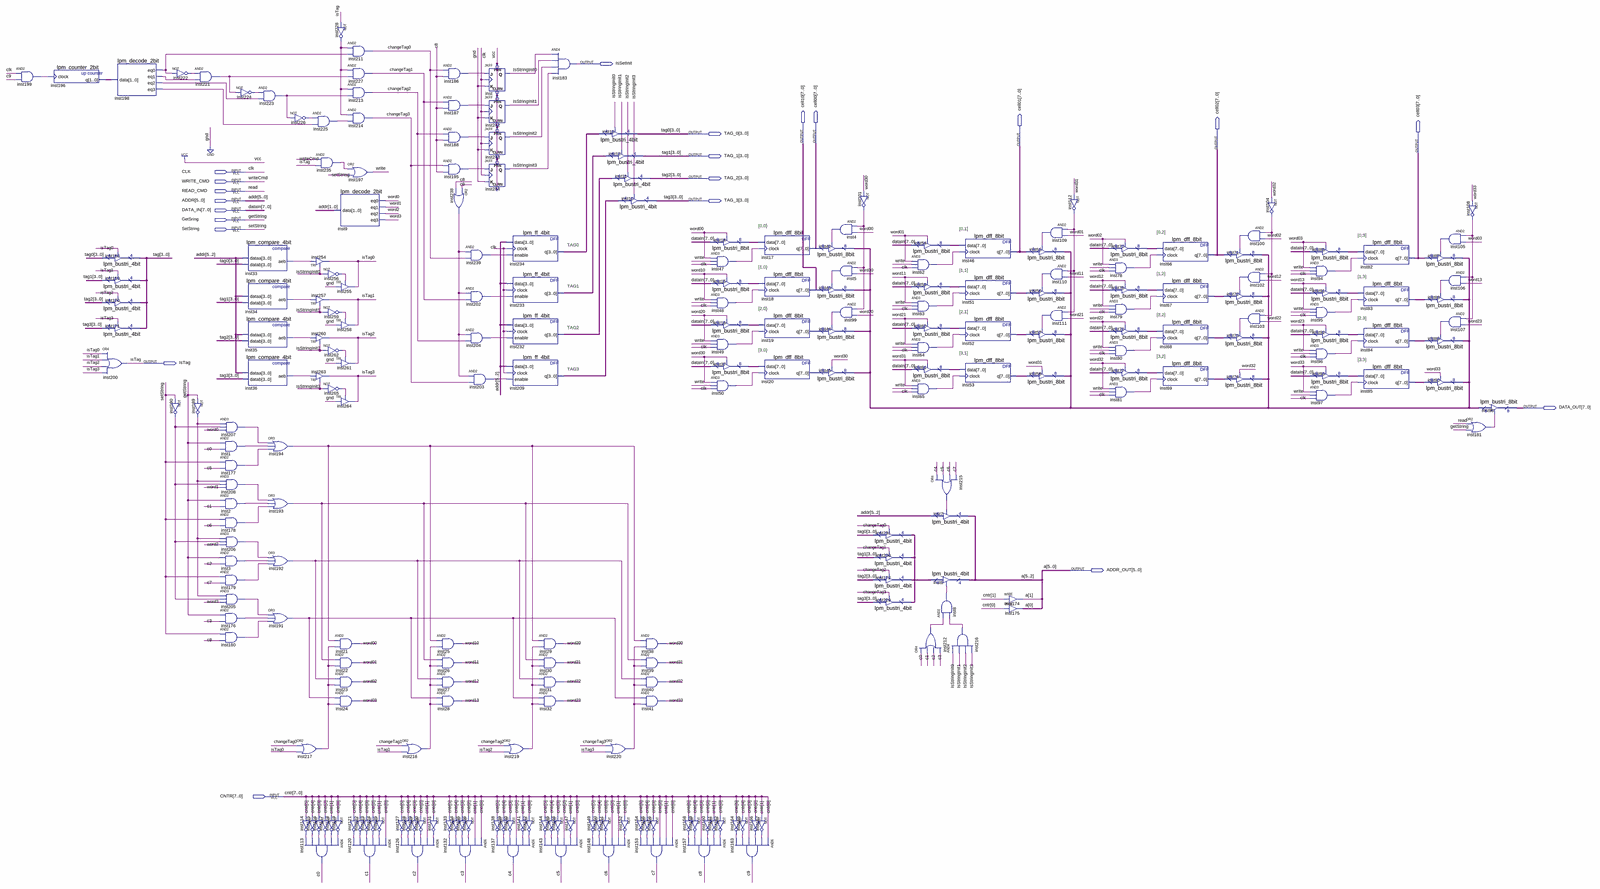
[diagram p0: schematic sheet, whole]
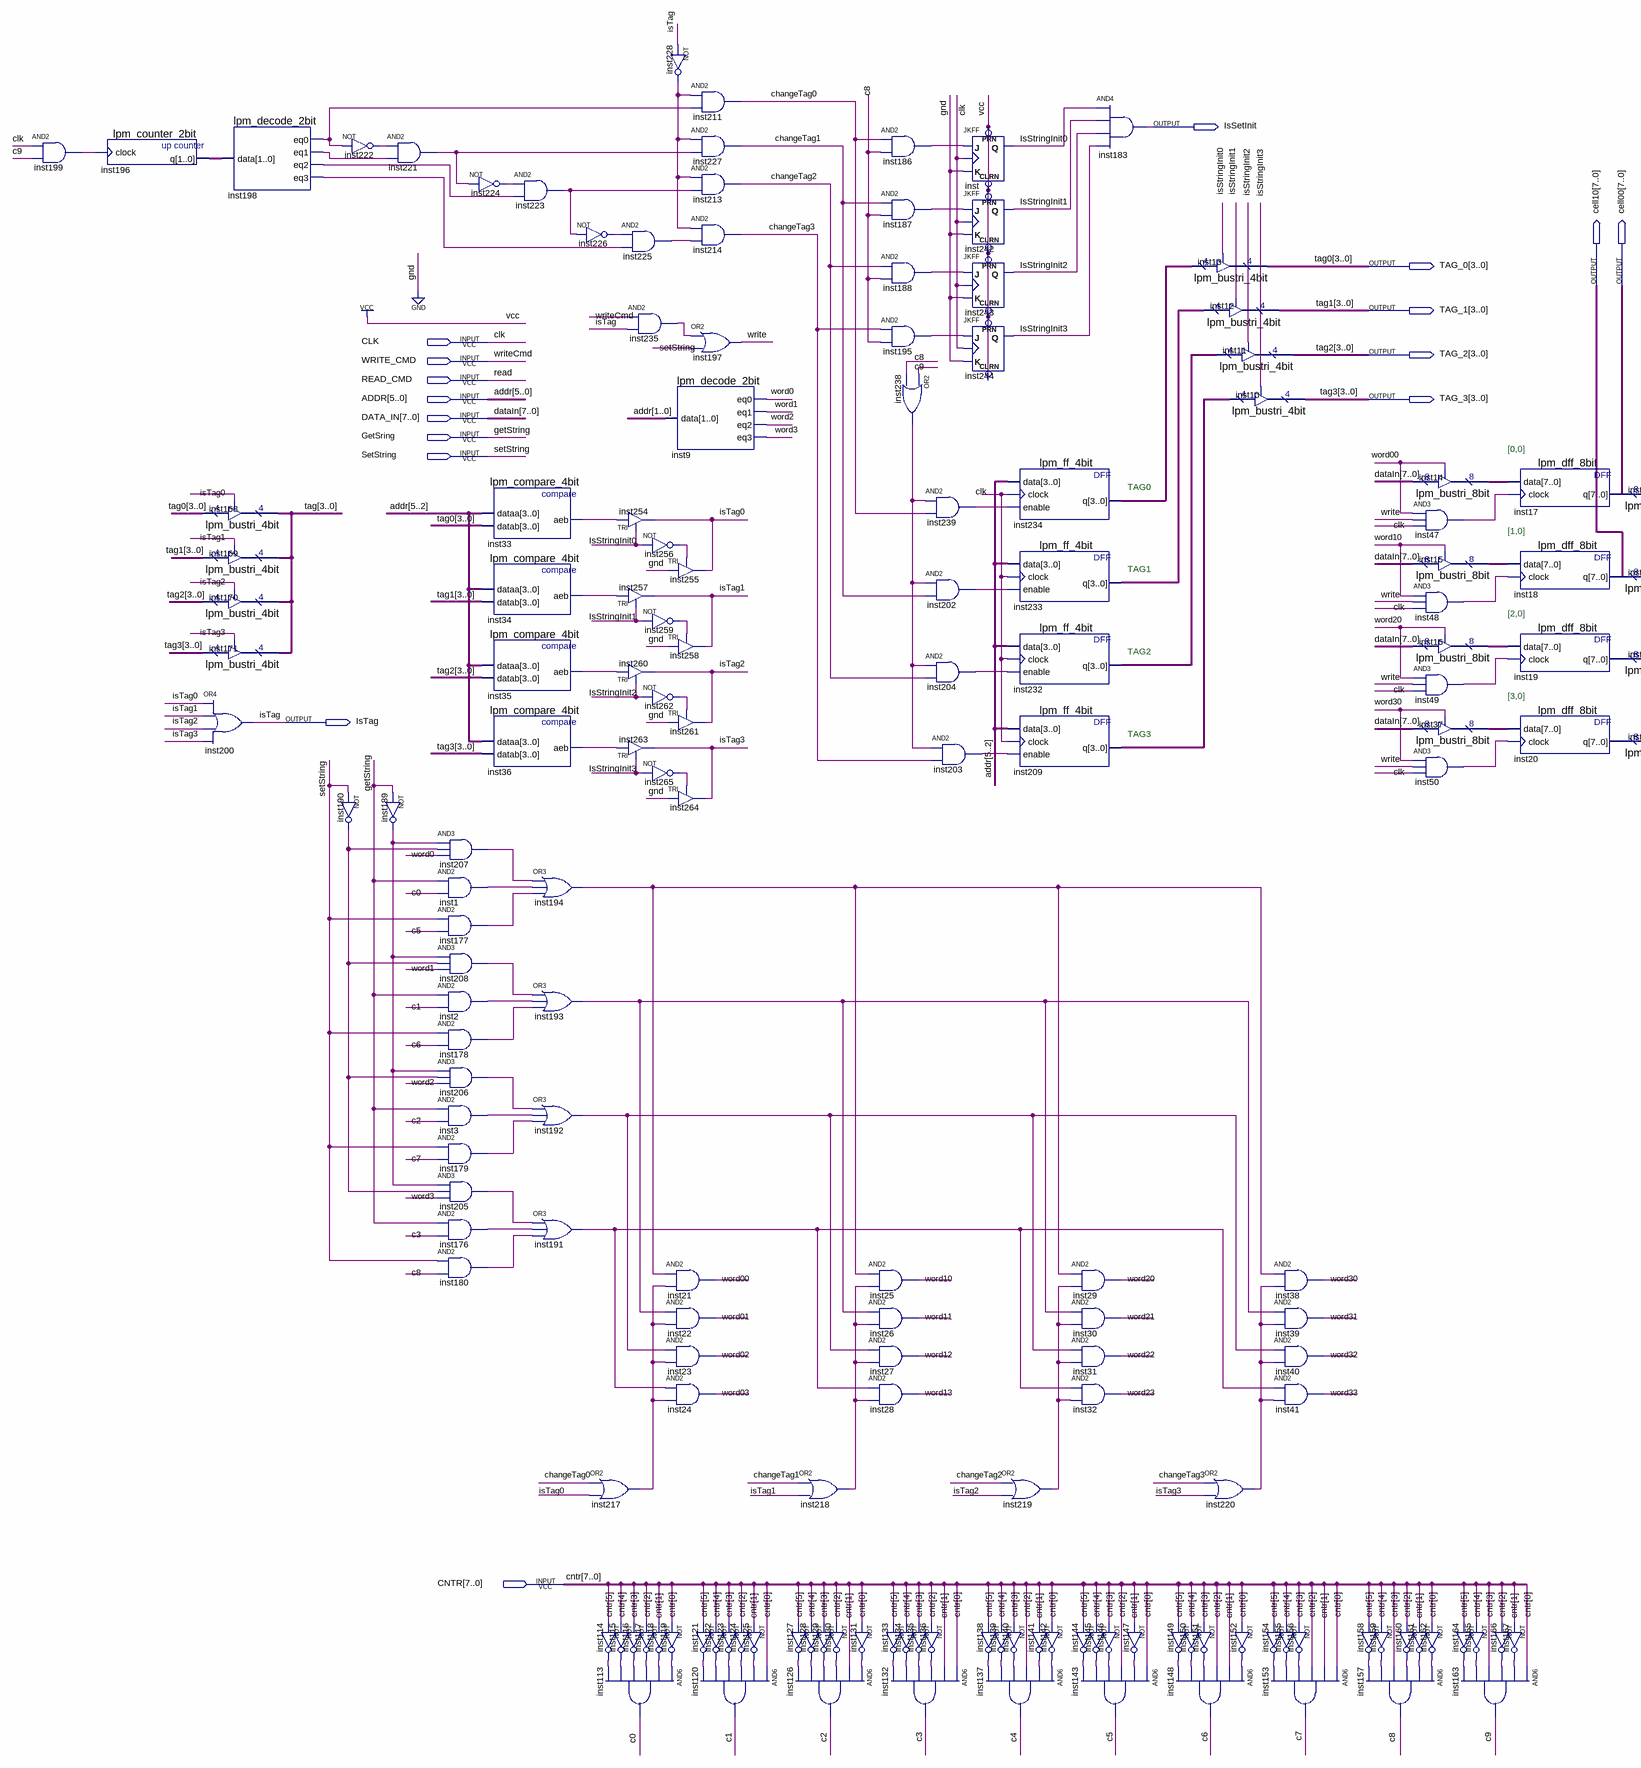
[diagram p1: schematic sheet, left part]
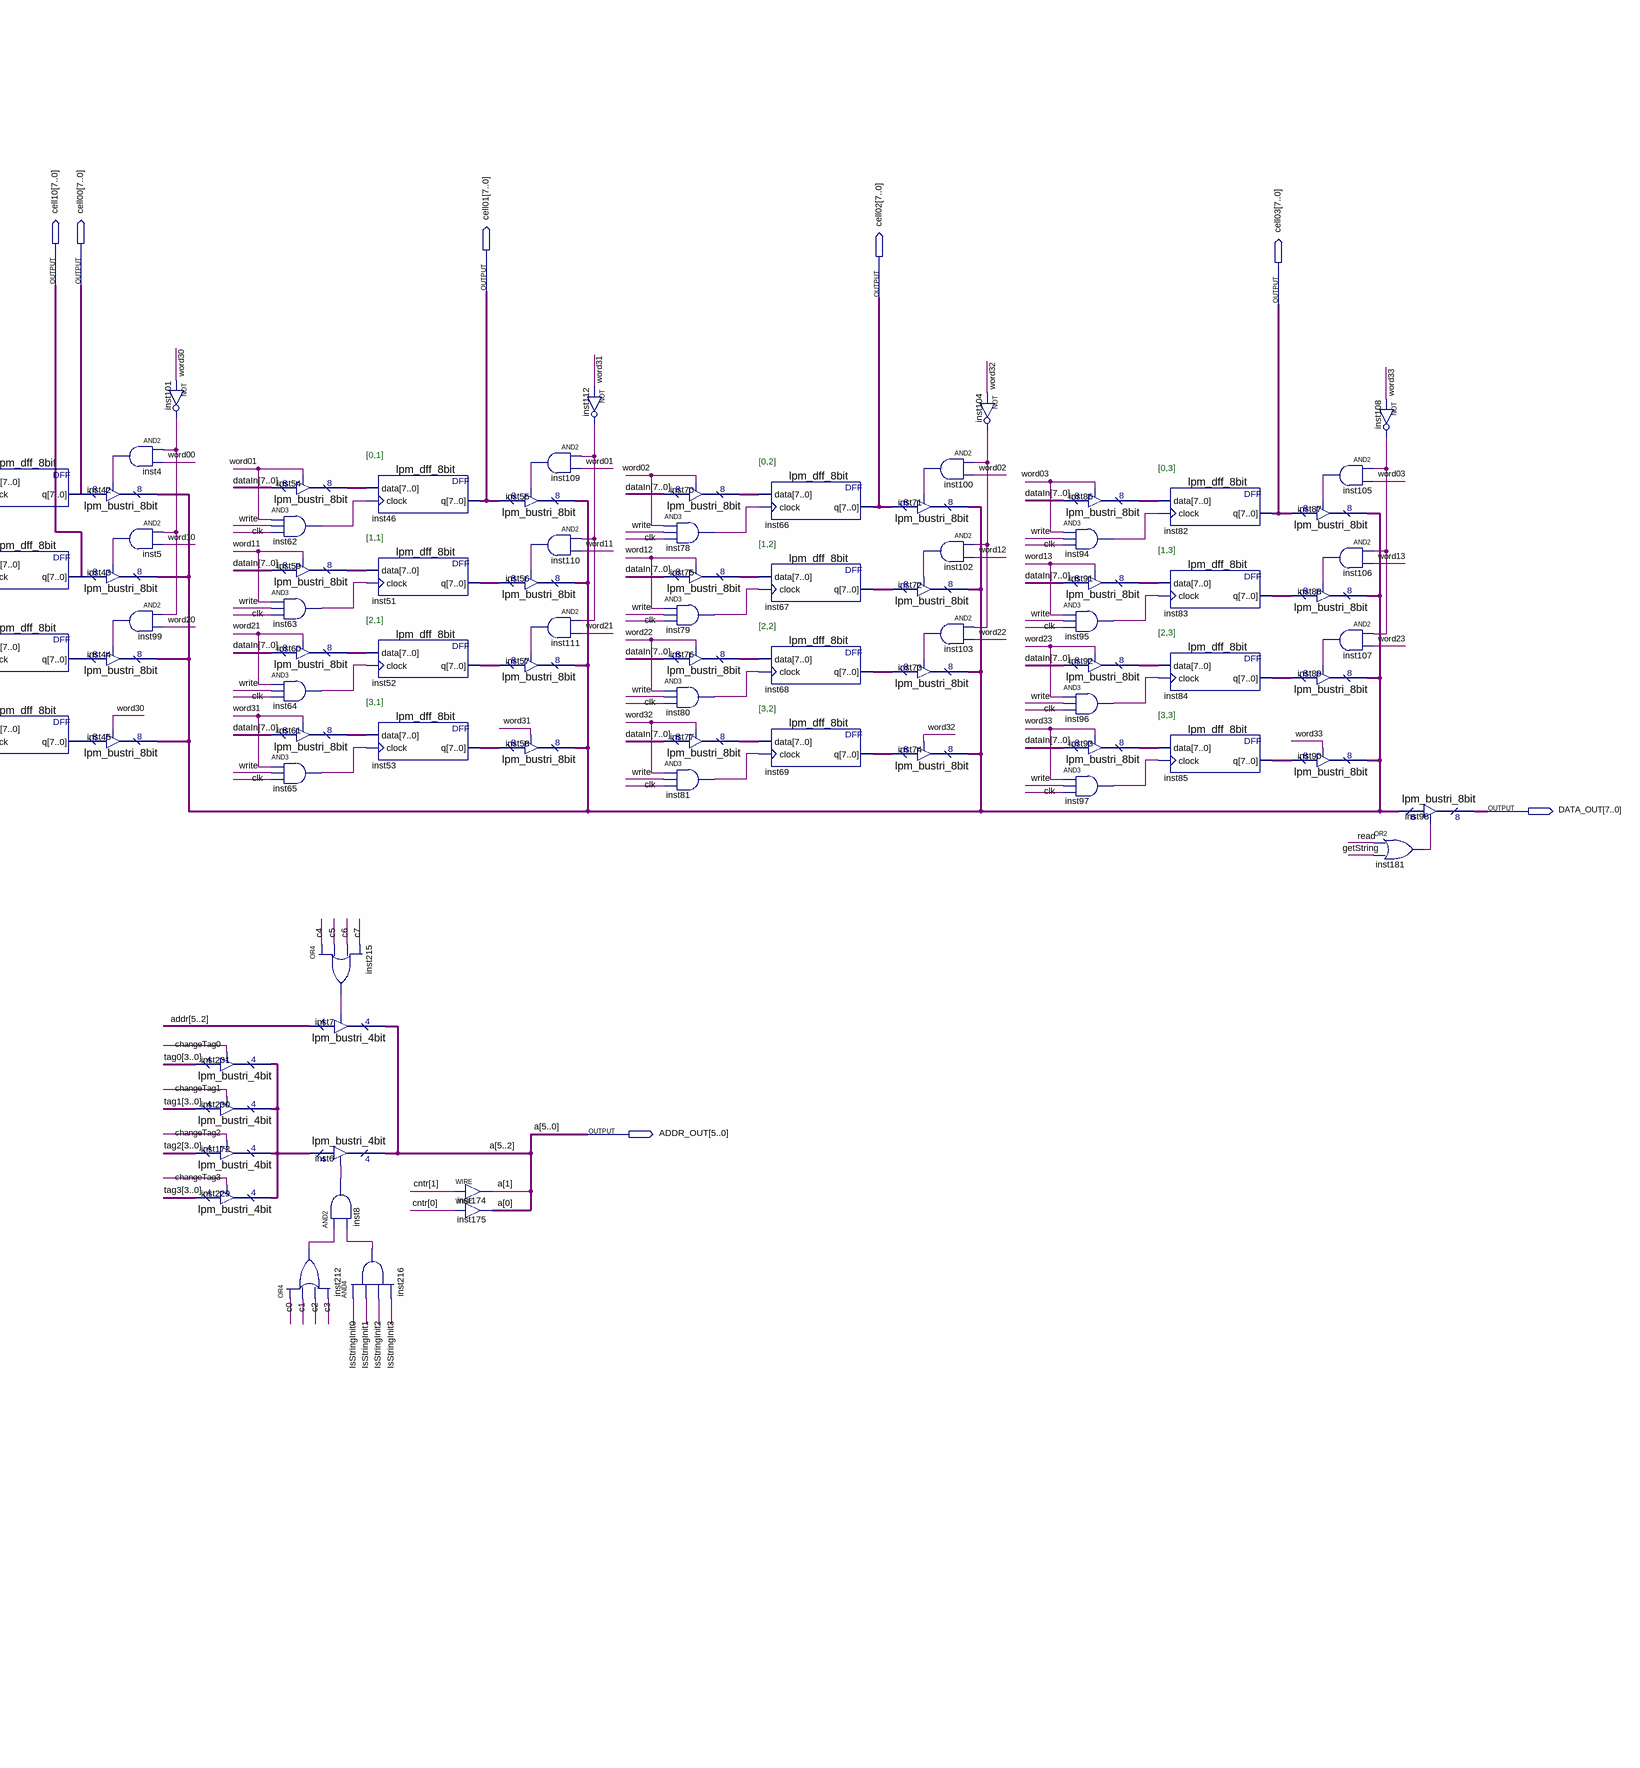
[diagram p2: schematic sheet, right part]
// Quartus schematic Set.bdf as structural Verilog: 247 symbols, 21 pins
module Set (
  input  CLK,
  input  WRITE_CMD,
  input  READ_CMD,
  input  [5:0] ADDR,
  input  [7:0] DATA_IN,
  input  GetSring,
  input  SetString,
  input  [7:0] CNTR,
  output IsSetInit,
  output [3:0] TAG_0,
  output [7:0] cell10,
  output [7:0] cell00,
  output [7:0] cell01,
  output [7:0] cell02,
  output [7:0] cell03,
  output [3:0] TAG_1,
  output [3:0] TAG_2,
  output [3:0] TAG_3,
  output IsTag,
  output [7:0] DATA_OUT,
  output [5:0] ADDR_OUT
);

  wire c0, c1, c2, c3, c4, c5, c6, c7, c8, c9, changeTag0, changeTag1, changeTag2, changeTag3, inst1_out,
       inst2_out, inst3_out, inst4_out, inst5_out, inst8_out, inst33_aeb, inst34_aeb, inst35_aeb, inst36_aeb,
       inst47_out, inst48_out, inst49_out, inst50_out, inst62_out, inst63_out, inst64_out, inst65_out,
       inst78_out, inst79_out, inst80_out, inst81_out, inst94_out, inst95_out, inst96_out, inst97_out,
       inst99_out, inst100_out, inst101_out, inst102_out, inst103_out, inst104_out, inst105_out, inst106_out,
       inst107_out, inst108_out, inst109_out, inst110_out, inst111_out, inst112_out, inst114_out,
       inst115_out, inst116_out, inst117_out, inst118_out, inst119_out, inst121_out, inst122_out,
       inst123_out, inst124_out, inst125_out, inst127_out, inst128_out, inst129_out, inst130_out,
       inst131_out, inst133_out, inst134_out, inst135_out, inst136_out, inst138_out, inst139_out,
       inst140_out, inst141_out, inst142_out, inst144_out, inst145_out, inst146_out, inst147_out,
       inst149_out, inst150_out, inst151_out, inst152_out, inst154_out, inst155_out, inst156_out,
       inst158_out, inst159_out, inst160_out, inst161_out, inst162_out, inst164_out, inst165_out,
       inst166_out, inst167_out, inst176_out, inst177_out, inst178_out, inst179_out, inst180_out,
       inst181_out, inst186_out, inst187_out, inst188_out, inst189_out, inst190_out, inst191_out,
       inst192_out, inst193_out, inst194_out, inst195_out, inst198_eq0, inst198_eq1, inst198_eq2,
       inst198_eq3, inst199_out, inst202_out, inst203_out, inst204_out, inst205_out, inst206_out,
       inst207_out, inst208_out, inst212_out, inst215_out, inst216_out, inst217_out, inst218_out,
       inst219_out, inst220_out, inst221_out, inst222_out, inst223_out, inst224_out, inst225_out,
       inst226_out, inst228_out, inst235_out, inst238_out, inst239_out, inst256_out, inst259_out,
       inst262_out, inst265_out, isStringInit0, isStringInit1, isStringInit2, isStringInit3, isTag0, isTag1,
       isTag2, isTag3, word0, word00, word1, word01, word02, word2, word3, word03, word10, word11, word12,
       word13, word20, word21, word22, word23, word30, word31, word32, word33, write;
  wire [1:0] inst196_q;
  wire [3:0] inst209_q, inst231_tridata, inst232_q, inst233_q, inst234_q, tag;
  wire [7:0] inst14_tridata, inst15_tridata, inst16_tridata, inst19_q, inst20_q, inst37_tridata,
       inst42_tridata, inst51_q, inst52_q, inst53_q, inst54_tridata, inst59_tridata, inst60_tridata,
       inst61_tridata, inst67_q, inst68_q, inst69_q, inst70_tridata, inst75_tridata, inst76_tridata,
       inst77_tridata, inst83_q, inst84_q, inst85_q, inst86_tridata, inst91_tridata, inst92_tridata,
       inst93_tridata;

  and inst199 (inst199_out, CLK, c9);
  lpm_counter_2bit inst196 (.clock(inst199_out), .q(inst196_q));
  lpm_decode_2bit inst198 (
    .data(inst196_q), .eq0(inst198_eq0), .eq1(inst198_eq1), .eq2(inst198_eq2), .eq3(inst198_eq3));
  lpm_bustri_4bit inst168 (.enabledt(isTag0), .data(TAG_0), .tridata(tag));
  lpm_bustri_4bit inst169 (.enabledt(isTag1), .data(TAG_1), .tridata(tag));
  lpm_bustri_4bit inst170 (.enabledt(isTag2), .data(TAG_2), .tridata(tag));
  lpm_bustri_4bit inst171 (.enabledt(isTag3), .data(TAG_3), .tridata(tag));
  or inst200 (IsTag, isTag0, isTag1, isTag2, isTag3);
  not inst190 (inst190_out, SetString);
  and inst221 (inst221_out, inst222_out, inst198_eq1);
  not inst222 (inst222_out, inst198_eq0);
  not inst189 (inst189_out, GetSring);
  and inst207 (inst207_out, inst189_out, inst190_out, word0);
  and inst1 (inst1_out, GetSring, c0);
  and inst177 (inst177_out, SetString, c5);
  and inst208 (inst208_out, inst189_out, inst190_out, word1);
  and inst2 (inst2_out, GetSring, c1);
  and inst178 (inst178_out, SetString, c6);
  and inst206 (inst206_out, inst189_out, inst190_out, word2);
  and inst3 (inst3_out, GetSring, c2);
  and inst179 (inst179_out, SetString, c7);
  and inst205 (inst205_out, inst189_out, inst190_out, word3);
  and inst176 (inst176_out, GetSring, c3);
  and inst180 (inst180_out, SetString, c8);
  not inst224 (inst224_out, inst221_out);
  lpm_compare_4bit inst33 (.dataa(ADDR[5:2]), .datab(TAG_0), .aeb(inst33_aeb));
  lpm_compare_4bit inst34 (.dataa(ADDR[5:2]), .datab(TAG_1), .aeb(inst34_aeb));
  lpm_compare_4bit inst35 (.dataa(ADDR[5:2]), .datab(TAG_2), .aeb(inst35_aeb));
  lpm_compare_4bit inst36 (.dataa(ADDR[5:2]), .datab(TAG_3), .aeb(inst36_aeb));
  and inst223 (inst223_out, inst224_out, inst198_eq2);
  or inst194 (inst194_out, inst207_out, inst1_out, inst177_out);
  or inst193 (inst193_out, inst208_out, inst2_out, inst178_out);
  or inst192 (inst192_out, inst206_out, inst3_out, inst179_out);
  or inst191 (inst191_out, inst205_out, inst176_out, inst180_out);
  not inst226 (inst226_out, inst223_out);
  or inst217 (inst217_out, changeTag0, isTag0);
  and inst225 (inst225_out, inst226_out, inst198_eq3);
  and inst235 (inst235_out, WRITE_CMD, IsTag);
  TRI inst254 (.IN(inst33_aeb), .OE(isStringInit0), .OUT(isTag0));
  not inst256 (inst256_out, isStringInit0);
  TRI inst257 (.IN(inst34_aeb), .OE(isStringInit1), .OUT(isTag1));
  not inst259 (inst259_out, isStringInit1);
  TRI inst260 (.IN(inst35_aeb), .OE(isStringInit2), .OUT(isTag2));
  not inst262 (inst262_out, isStringInit2);
  TRI inst263 (.IN(inst36_aeb), .OE(isStringInit3), .OUT(isTag3));
  not inst265 (inst265_out, isStringInit3);
  not inst114 (inst114_out, CNTR[5]);
  not inst115 (inst115_out, CNTR[4]);
  not inst116 (inst116_out, CNTR[3]);
  not inst117 (inst117_out, CNTR[2]);
  and inst113 (c0, inst119_out, inst118_out, inst117_out, inst116_out, inst115_out, inst114_out);
  not inst228 (inst228_out, IsTag);
  and inst211 (changeTag0, inst228_out, inst198_eq0);
  and inst227 (changeTag1, inst228_out, inst221_out);
  and inst213 (changeTag2, inst228_out, inst223_out);
  and inst214 (changeTag3, inst228_out, inst225_out);
  or inst197 (write, inst235_out, SetString);
  lpm_decode_2bit inst9 (.data(ADDR[1:0]), .eq0(word0), .eq1(word1), .eq2(word2), .eq3(word3));
  TRI inst255 (.IN(1'b0), .OE(inst256_out), .OUT(isTag0));
  TRI inst258 (.IN(1'b0), .OE(inst259_out), .OUT(isTag1));
  TRI inst261 (.IN(1'b0), .OE(inst262_out), .OUT(isTag2));
  TRI inst264 (.IN(1'b0), .OE(inst265_out), .OUT(isTag3));
  and inst21 (word00, inst194_out, inst217_out);
  and inst22 (word01, inst193_out, inst217_out);
  and inst23 (word02, inst192_out, inst217_out);
  and inst24 (word03, inst191_out, inst217_out);
  not inst118 (inst118_out, CNTR[1]);
  not inst119 (inst119_out, CNTR[0]);
  not inst121 (inst121_out, CNTR[5]);
  and inst120 (c1, CNTR[0], inst125_out, inst124_out, inst123_out, inst122_out, inst121_out);
  not inst122 (inst122_out, CNTR[4]);
  not inst123 (inst123_out, CNTR[3]);
  not inst124 (inst124_out, CNTR[2]);
  not inst125 (inst125_out, CNTR[1]);
  not inst127 (inst127_out, CNTR[5]);
  and inst126 (c2, inst131_out, CNTR[1], inst130_out, inst129_out, inst128_out, inst127_out);
  or inst218 (inst218_out, changeTag1, isTag1);
  not inst128 (inst128_out, CNTR[4]);
  not inst129 (inst129_out, CNTR[3]);
  not inst130 (inst130_out, CNTR[2]);
  and inst186 (inst186_out, changeTag0, c8);
  and inst187 (inst187_out, changeTag1, c8);
  and inst188 (inst188_out, changeTag2, c8);
  and inst195 (inst195_out, changeTag3, c8);
  or inst238 (inst238_out, c9, c8);
  and inst25 (word10, inst194_out, inst218_out);
  and inst26 (word11, inst193_out, inst218_out);
  and inst27 (word12, inst192_out, inst218_out);
  and inst28 (word13, inst191_out, inst218_out);
  not inst131 (inst131_out, CNTR[0]);
  not inst133 (inst133_out, CNTR[5]);
  not inst134 (inst134_out, CNTR[4]);
  and inst132 (c3, CNTR[0], CNTR[1], inst136_out, inst135_out, inst134_out, inst133_out);
  and inst239 (inst239_out, inst238_out, changeTag0);
  and inst202 (inst202_out, inst238_out, changeTag1);
  and inst204 (inst204_out, inst238_out, changeTag2);
  and inst203 (inst203_out, inst238_out, changeTag3);
  not inst135 (inst135_out, CNTR[3]);
  not inst136 (inst136_out, CNTR[2]);
  JKFF inst (.PRN(1'b1), .CLRN(1'b1), .K(1'b0), .J(inst186_out), .CLK(CLK), .Q(isStringInit0));
  JKFF inst242 (.PRN(1'b1), .CLRN(1'b1), .K(1'b0), .J(inst187_out), .CLK(CLK), .Q(isStringInit1));
  JKFF inst243 (.PRN(1'b1), .CLRN(1'b1), .K(1'b0), .J(inst188_out), .CLK(CLK), .Q(isStringInit2));
  JKFF inst244 (.PRN(1'b1), .CLRN(1'b1), .K(1'b0), .J(inst195_out), .CLK(CLK), .Q(isStringInit3));
  not inst138 (inst138_out, CNTR[5]);
  not inst139 (inst139_out, CNTR[4]);
  and inst137 (c4, inst142_out, inst141_out, CNTR[2], inst140_out, inst139_out, inst138_out);
  lpm_ff_4bit inst234 (.data(ADDR[5:2]), .clock(CLK), .enable(inst239_out), .q(inst234_q));
  lpm_ff_4bit inst233 (.data(ADDR[5:2]), .clock(CLK), .enable(inst202_out), .q(inst233_q));
  lpm_ff_4bit inst232 (.data(ADDR[5:2]), .clock(CLK), .enable(inst204_out), .q(inst232_q));
  lpm_ff_4bit inst209 (.data(ADDR[5:2]), .clock(CLK), .enable(inst203_out), .q(inst209_q));
  or inst219 (inst219_out, changeTag2, isTag2);
  not inst140 (inst140_out, CNTR[3]);
  not inst141 (inst141_out, CNTR[1]);
  not inst142 (inst142_out, CNTR[0]);
  and inst183 (IsSetInit, isStringInit0, isStringInit1, isStringInit2, isStringInit3);
  and inst29 (word20, inst194_out, inst219_out);
  and inst30 (word21, inst193_out, inst219_out);
  and inst31 (word22, inst192_out, inst219_out);
  and inst32 (word23, inst191_out, inst219_out);
  not inst144 (inst144_out, CNTR[5]);
  not inst145 (inst145_out, CNTR[4]);
  not inst146 (inst146_out, CNTR[3]);
  and inst143 (c5, CNTR[0], inst147_out, CNTR[2], inst146_out, inst145_out, inst144_out);
  not inst147 (inst147_out, CNTR[1]);
  lpm_bustri_4bit inst13 (.enabledt(isStringInit0), .data(inst234_q), .tridata(TAG_0));
  not inst149 (inst149_out, CNTR[5]);
  not inst150 (inst150_out, CNTR[4]);
  not inst151 (inst151_out, CNTR[3]);
  and inst148 (c6, inst152_out, CNTR[1], CNTR[2], inst151_out, inst150_out, inst149_out);
  lpm_bustri_4bit inst12 (.enabledt(isStringInit1), .data(inst233_q), .tridata(TAG_1));
  lpm_bustri_4bit inst11 (.enabledt(isStringInit2), .data(inst232_q), .tridata(TAG_2));
  lpm_bustri_4bit inst10 (.enabledt(isStringInit3), .data(inst209_q), .tridata(TAG_3));
  or inst220 (inst220_out, changeTag3, isTag3);
  not inst152 (inst152_out, CNTR[0]);
  and inst38 (word30, inst194_out, inst220_out);
  and inst39 (word31, inst193_out, inst220_out);
  and inst40 (word32, inst192_out, inst220_out);
  and inst41 (word33, inst191_out, inst220_out);
  not inst154 (inst154_out, CNTR[5]);
  not inst155 (inst155_out, CNTR[4]);
  not inst156 (inst156_out, CNTR[3]);
  and inst153 (c7, CNTR[0], CNTR[1], CNTR[2], inst156_out, inst155_out, inst154_out);
  not inst158 (inst158_out, CNTR[5]);
  not inst159 (inst159_out, CNTR[4]);
  not inst160 (inst160_out, CNTR[2]);
  and inst157 (c8, inst162_out, inst161_out, inst160_out, CNTR[3], inst159_out, inst158_out);
  lpm_bustri_8bit inst14 (.enabledt(word00), .data(DATA_IN), .tridata(inst14_tridata));
  and inst47 (inst47_out, word00, write, CLK);
  lpm_bustri_8bit inst15 (.enabledt(word10), .data(DATA_IN), .tridata(inst15_tridata));
  and inst48 (inst48_out, word10, write, CLK);
  lpm_bustri_8bit inst16 (.enabledt(word20), .data(DATA_IN), .tridata(inst16_tridata));
  and inst49 (inst49_out, word20, write, CLK);
  lpm_bustri_8bit inst37 (.enabledt(word30), .data(DATA_IN), .tridata(inst37_tridata));
  and inst50 (inst50_out, word30, write, CLK);
  not inst161 (inst161_out, CNTR[1]);
  not inst162 (inst162_out, CNTR[0]);
  not inst164 (inst164_out, CNTR[5]);
  and inst163 (c9, CNTR[0], inst167_out, inst166_out, CNTR[3], inst165_out, inst164_out);
  not inst165 (inst165_out, CNTR[4]);
  not inst166 (inst166_out, CNTR[2]);
  not inst167 (inst167_out, CNTR[1]);
  lpm_dff_8bit inst17 (.data(inst14_tridata), .clock(inst47_out), .q(cell00));
  lpm_dff_8bit inst18 (.data(inst15_tridata), .clock(inst48_out), .q(cell10));
  lpm_dff_8bit inst19 (.data(inst16_tridata), .clock(inst49_out), .q(inst19_q));
  lpm_dff_8bit inst20 (.data(inst37_tridata), .clock(inst50_out), .q(inst20_q));
  and inst4 (inst4_out, inst101_out, word00);
  lpm_bustri_8bit inst42 (.enabledt(inst4_out), .data(cell00), .tridata(inst42_tridata));
  and inst5 (inst5_out, inst101_out, word10);
  lpm_bustri_8bit inst43 (.enabledt(inst5_out), .data(cell10), .tridata(inst42_tridata));
  and inst99 (inst99_out, inst101_out, word20);
  lpm_bustri_8bit inst44 (.enabledt(inst99_out), .data(inst19_q), .tridata(inst42_tridata));
  lpm_bustri_8bit inst45 (.enabledt(word30), .data(inst20_q), .tridata(inst42_tridata));
  not inst101 (inst101_out, word30);
  lpm_bustri_4bit inst231 (.enabledt(changeTag0), .data(TAG_0), .tridata(inst231_tridata));
  lpm_bustri_4bit inst230 (.enabledt(changeTag1), .data(TAG_1), .tridata(inst231_tridata));
  lpm_bustri_4bit inst172 (.enabledt(changeTag2), .data(TAG_2), .tridata(inst231_tridata));
  lpm_bustri_4bit inst229 (.enabledt(changeTag3), .data(TAG_3), .tridata(inst231_tridata));
  lpm_bustri_8bit inst54 (.enabledt(word01), .data(DATA_IN), .tridata(inst54_tridata));
  and inst62 (inst62_out, word01, write, CLK);
  lpm_bustri_8bit inst59 (.enabledt(word11), .data(DATA_IN), .tridata(inst59_tridata));
  and inst63 (inst63_out, word11, write, CLK);
  lpm_bustri_8bit inst60 (.enabledt(word21), .data(DATA_IN), .tridata(inst60_tridata));
  and inst64 (inst64_out, word21, write, CLK);
  lpm_bustri_8bit inst61 (.enabledt(word31), .data(DATA_IN), .tridata(inst61_tridata));
  and inst65 (inst65_out, word31, write, CLK);
  or inst215 (inst215_out, c4, c5, c6, c7);
  lpm_bustri_4bit inst7 (.enabledt(inst215_out), .data(ADDR[5:2]), .tridata(ADDR_OUT[5:2]));
  lpm_bustri_4bit inst6 (.enabledt(inst8_out), .data(inst231_tridata), .tridata(ADDR_OUT[5:2]));
  or inst212 (inst212_out, c0, c1, c2, c3);
  lpm_dff_8bit inst46 (.data(inst54_tridata), .clock(inst62_out), .q(cell01));
  lpm_dff_8bit inst51 (.data(inst59_tridata), .clock(inst63_out), .q(inst51_q));
  lpm_dff_8bit inst52 (.data(inst60_tridata), .clock(inst64_out), .q(inst52_q));
  lpm_dff_8bit inst53 (.data(inst61_tridata), .clock(inst65_out), .q(inst53_q));
  and inst8 (inst8_out, inst212_out, inst216_out);
  and inst216 (inst216_out, isStringInit0, isStringInit1, isStringInit2, isStringInit3);
  assign ADDR_OUT[1] = CNTR[1];  // WIRE inst174
  assign ADDR_OUT[0] = CNTR[0];  // WIRE inst175
  lpm_bustri_8bit inst55 (.enabledt(inst109_out), .data(cell01), .tridata(inst42_tridata));
  lpm_bustri_8bit inst56 (.enabledt(inst110_out), .data(inst51_q), .tridata(inst42_tridata));
  lpm_bustri_8bit inst57 (.enabledt(inst111_out), .data(inst52_q), .tridata(inst42_tridata));
  lpm_bustri_8bit inst58 (.enabledt(word31), .data(inst53_q), .tridata(inst42_tridata));
  and inst109 (inst109_out, inst112_out, word01);
  and inst110 (inst110_out, inst112_out, word11);
  and inst111 (inst111_out, inst112_out, word21);
  not inst112 (inst112_out, word31);
  lpm_bustri_8bit inst70 (.enabledt(word02), .data(DATA_IN), .tridata(inst70_tridata));
  and inst78 (inst78_out, word02, write, CLK);
  lpm_bustri_8bit inst75 (.enabledt(word12), .data(DATA_IN), .tridata(inst75_tridata));
  and inst79 (inst79_out, word12, write, CLK);
  lpm_bustri_8bit inst76 (.enabledt(word22), .data(DATA_IN), .tridata(inst76_tridata));
  and inst80 (inst80_out, word22, write, CLK);
  lpm_bustri_8bit inst77 (.enabledt(word32), .data(DATA_IN), .tridata(inst77_tridata));
  and inst81 (inst81_out, word32, write, CLK);
  lpm_dff_8bit inst66 (.data(inst70_tridata), .clock(inst78_out), .q(cell02));
  lpm_dff_8bit inst67 (.data(inst75_tridata), .clock(inst79_out), .q(inst67_q));
  lpm_dff_8bit inst68 (.data(inst76_tridata), .clock(inst80_out), .q(inst68_q));
  lpm_dff_8bit inst69 (.data(inst77_tridata), .clock(inst81_out), .q(inst69_q));
  and inst100 (inst100_out, inst104_out, word02);
  lpm_bustri_8bit inst71 (.enabledt(inst100_out), .data(cell02), .tridata(inst42_tridata));
  and inst102 (inst102_out, inst104_out, word12);
  lpm_bustri_8bit inst72 (.enabledt(inst102_out), .data(inst67_q), .tridata(inst42_tridata));
  and inst103 (inst103_out, inst104_out, word22);
  lpm_bustri_8bit inst73 (.enabledt(inst103_out), .data(inst68_q), .tridata(inst42_tridata));
  lpm_bustri_8bit inst74 (.enabledt(word32), .data(inst69_q), .tridata(inst42_tridata));
  not inst104 (inst104_out, word32);
  lpm_bustri_8bit inst86 (.enabledt(word03), .data(DATA_IN), .tridata(inst86_tridata));
  and inst94 (inst94_out, word03, write, CLK);
  lpm_bustri_8bit inst91 (.enabledt(word13), .data(DATA_IN), .tridata(inst91_tridata));
  and inst95 (inst95_out, word13, write, CLK);
  lpm_bustri_8bit inst92 (.enabledt(word23), .data(DATA_IN), .tridata(inst92_tridata));
  and inst96 (inst96_out, word23, write, CLK);
  lpm_bustri_8bit inst93 (.enabledt(word33), .data(DATA_IN), .tridata(inst93_tridata));
  and inst97 (inst97_out, word33, write, CLK);
  lpm_dff_8bit inst82 (.data(inst86_tridata), .clock(inst94_out), .q(cell03));
  lpm_dff_8bit inst83 (.data(inst91_tridata), .clock(inst95_out), .q(inst83_q));
  lpm_dff_8bit inst84 (.data(inst92_tridata), .clock(inst96_out), .q(inst84_q));
  lpm_dff_8bit inst85 (.data(inst93_tridata), .clock(inst97_out), .q(inst85_q));
  and inst105 (inst105_out, inst108_out, word03);
  lpm_bustri_8bit inst87 (.enabledt(inst105_out), .data(cell03), .tridata(inst42_tridata));
  and inst106 (inst106_out, inst108_out, word13);
  lpm_bustri_8bit inst88 (.enabledt(inst106_out), .data(inst83_q), .tridata(inst42_tridata));
  and inst107 (inst107_out, inst108_out, word23);
  lpm_bustri_8bit inst89 (.enabledt(inst107_out), .data(inst84_q), .tridata(inst42_tridata));
  lpm_bustri_8bit inst90 (.enabledt(word33), .data(inst85_q), .tridata(inst42_tridata));
  not inst108 (inst108_out, word33);
  or inst181 (inst181_out, READ_CMD, GetSring);
  lpm_bustri_8bit inst98 (.enabledt(inst181_out), .data(inst42_tridata), .tridata(DATA_OUT));

  // Other names for the same wires on the sheet: a[5:0] = ADDR_OUT; dataIn[7:0] = DATA_IN; getString = GetSring;
  //   read = READ_CMD; tag0[3:0] = TAG_0; tag1[3:0] = TAG_1; tag2[3:0] = TAG_2; tag3[3:0] = TAG_3;
  //   writeCmd = WRITE_CMD

  // Notes on the sheet:
  //   [0,0]
  //   [0,1]
  //   [0,2]
  //   [0,3]
  //   TAG0
  //   [1,0]
  //   [1,1]
  //   [1,2]
  //   [1,3]
  //   TAG1
  //   [2,0]
  //   [2,1]
  //   [2,2]
  //   [2,3]
  //   TAG2
  //   [3,0]
  //   [3,1]
  //   [3,2]
  //   [3,3]
  //   TAG3
endmodule
